# EAGLE schematic LEMSv2 (EAGLE 7.6.0)
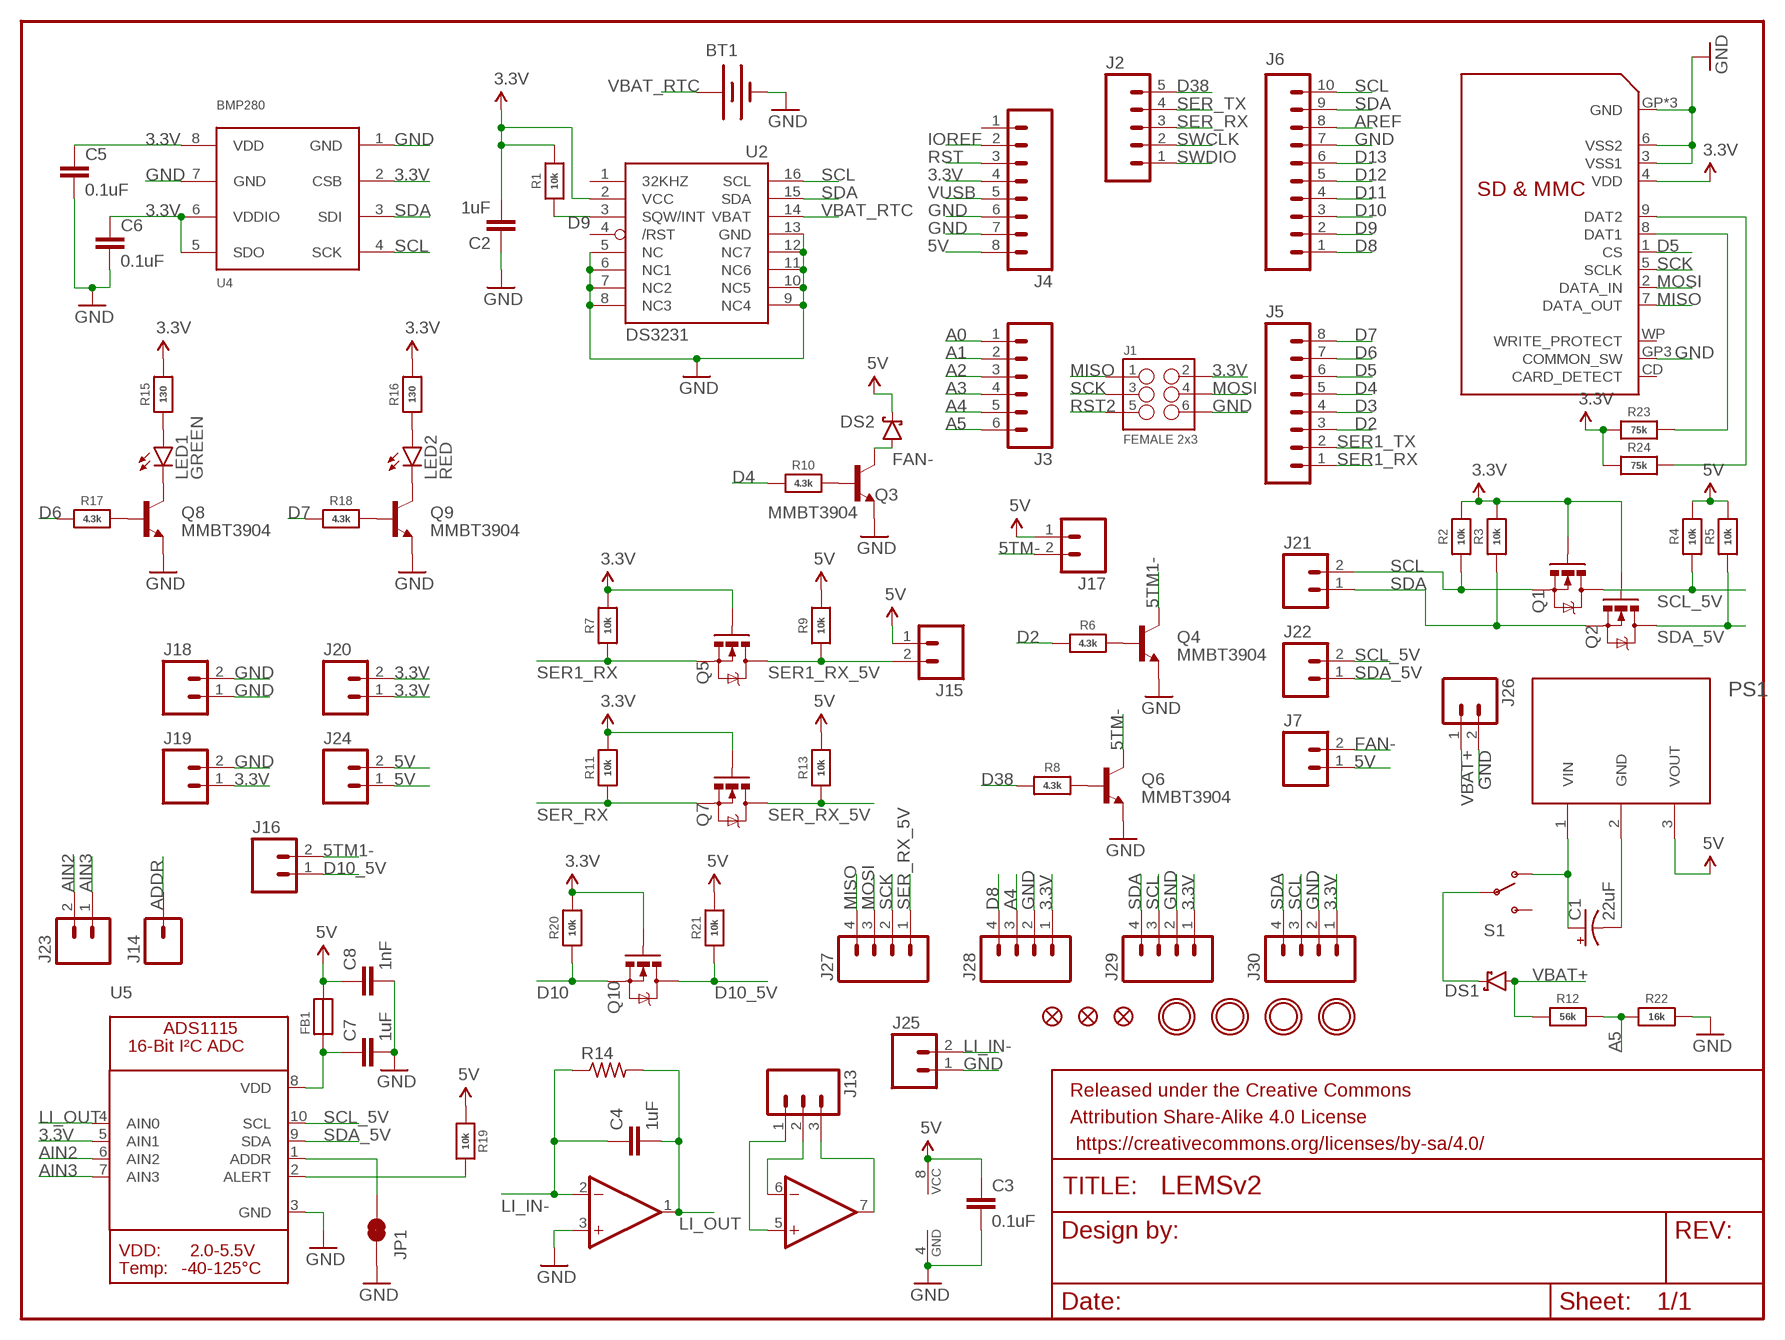
[diagram p0: schematic, sheet 1]

## Parts
BT1  BATTERY12MM  [BATTCON_12MM]
C1  22uF  CAP_POLPTH2  [CPOL-RADIAL-10UF-25V]
C2  1uF  CAP  [_0805]
C3  0.1uF  CAP  [_0805]
C4  1uF  CAP  [_0805]
C5  0.1uF  CAP  [_0805]
C6  0.1uF  CAP  [_0805]
C7  1uF  CAP  [_0805]
C8  1nF  CAP  [_0805]
DS1  DIODE_SCHOTTKY  [DO-214AC]
DS2  DIODE_SCHOTTKY  [DO-214AC]
FB1  FERRITE  [_0805]
FID1  FIDUCIAL""  [FIDUCIAL_1MM]
FID2  FIDUCIAL""  [FIDUCIAL_1MM]
FID3  FIDUCIAL""  [FIDUCIAL_1MM]
FRAME1  FRAME-LETTERNO_PACKAGE  [DUMMY]
J1  FEMALE 2x3  M03X2FEMALE  [2X3]
J2  M05PTH  [1X05]
J3  M06SILK_FEMALE_PTH  [1X06]
J4  M08  [1X08_ROUND]
J5  M08  [1X08_ROUND]
J6  M10SILK_FEMALE_PTH  [1X10]
J7  M023.5MM  [SCREWTERMINAL-3.5MM-2]
J13  M03PTH  [1X03]
J14  M01PTH  [1X01]
J15  M023.5MM  [SCREWTERMINAL-3.5MM-2]
J16  M023.5MM  [SCREWTERMINAL-3.5MM-2]
J17  M023.5MM  [SCREWTERMINAL-3.5MM-2]
J18  M023.5MM  [SCREWTERMINAL-3.5MM-2]
J19  M023.5MM  [SCREWTERMINAL-3.5MM-2]
J20  M023.5MM  [SCREWTERMINAL-3.5MM-2]
J21  M023.5MM  [SCREWTERMINAL-3.5MM-2]
J22  M023.5MM  [SCREWTERMINAL-3.5MM-2]
J23  M023.5MM  [SCREWTERMINAL-3.5MM-2]
J24  M023.5MM  [SCREWTERMINAL-3.5MM-2]
J25  M023.5MM  [SCREWTERMINAL-3.5MM-2]
J26  M023.5MM  [SCREWTERMINAL-3.5MM-2]
J27  M04SCREW  [SCREWTERMINAL-3.5MM-4]
J28  M04SCREW  [SCREWTERMINAL-3.5MM-4]
J29  M04SCREW  [SCREWTERMINAL-3.5MM-4]
J30  M04SCREW  [SCREWTERMINAL-3.5MM-4]
JP1  JUMPER-PAD-2-NC_BY_TRACE  [PAD-JUMPER-2-NC_BY_TRACE_YES_SILK]
LED1  GREEN  LED_GREEN  [LED-0603]
LED2  RED  LED_RED  [LED-0603]
PS1  TSR_1-2450  [TSR_1-2450]
Q1  200mA/50V  MOSFET-NCHANNELBSS138  [SOT23-3]
Q2  200mA/50V  MOSFET-NCHANNELBSS138  [SOT23-3]
Q3  MMBT3904  [SOT23-3]
Q4  MMBT3904  [SOT23-3]
Q5  200mA/50V  MOSFET-NCHANNELBSS138  [SOT23-3]
Q6  MMBT3904  [SOT23-3]
Q7  200mA/50V  MOSFET-NCHANNELBSS138  [SOT23-3]
Q8  MMBT3904  [SOT23-3]
Q9  MMBT3904  [SOT23-3]
Q10  200mA/50V  MOSFET-NCHANNELBSS138  [SOT23-3]
R1  10k  RESISTOR_0805  [_0805]
R2  10k  RESISTOR_0805  [_0805]
R3  10k  RESISTOR_0805  [_0805]
R4  10k  RESISTOR_0805  [_0805]
R5  10k  RESISTOR_0805  [_0805]
R6  4.3k  RESISTOR_0805  [_0805]
R7  10k  RESISTOR_0805  [_0805]
R8  4.3k  RESISTOR_0805  [_0805]
R9  10k  RESISTOR_0805  [_0805]
R10  4.3k  RESISTOR_0805  [_0805]
R11  10k  RESISTOR_0805  [_0805]
R12  56k  RESISTOR_0805  [_0805]
R13  10k  RESISTOR_0805  [_0805]
R14  R-US_FLIPFLOP  [0805-THM]
R15  130  RESISTOR_0805  [_0805]
R16  130  RESISTOR_0805  [_0805]
R17  4.3k  RESISTOR_0805  [_0805]
R18  4.3k  RESISTOR_0805  [_0805]
R19  10k  RESISTOR_0805  [_0805]
R20  10k  RESISTOR_0805  [_0805]
R21  10k  RESISTOR_0805  [_0805]
R22  16k  RESISTOR_0805  [_0805]
R23  75k  RESISTOR_0805  [_0805]
R24  75k  RESISTOR_0805  [_0805]
S1  SWITCH-SPDTPTH  [SWITCH-SPDT]
U1  SDMMC06132  [06132]
U2  DS3231/SO  [SO16W]
U3  TLV2372  [SOIC8]
U4  BMP280  [BMP280]
U5  ADC_ADS1115  [MSOP10]
U$1  MOUNTINGHOLE2.5  [MOUNTINGHOLE_2.5_PLATED]
U$2  MOUNTINGHOLE2.5  [MOUNTINGHOLE_2.5_PLATED]
U$3  MOUNTINGHOLE2.5  [MOUNTINGHOLE_2.5_PLATED]
U$4  MOUNTINGHOLE2.5  [MOUNTINGHOLE_2.5_PLATED]

## Nets
3.3V: C2.2 C5.1 C6.1 J1.2 J4.4 J19.1 J20.1 J20.2 J28.1 J29.1 J30.1 Q1.1(G) Q2.1(G) Q5.1(G) Q7.1(G) Q10.1(G) R1.2 R2.2 R3.2 R7.2 R11.2 R15.2 R16.2 R20.2 R23.1 R24.1 U1.4(VDD) U2.2(VCC) U4.2(CSB) U4.5(SDO) U4.6(VDDIO) U4.8(VDD) U5.5(AIN1)
5TM1-: J16.2 Q4.3(C)
5TM-: J17.2 Q6.3(C)
5V: C3.1 C8.1 DS2.C FB1.2 J4.8 J7.1 J15.1 J17.1 J24.1 J24.2 PS1.3(VOUT) R4.2 R5.2 R9.2 R13.2 R19.1 R21.2 U3.8(TLV2372-PWRN:VCC)
A0: J3.1
A1: J3.2
A2: J3.3
A3: J3.4
A4: J3.5 J28.3
A5: J3.6 R12.2 R22.1
ADDR: J14.1 JP1.1 U5.1(ADDR)
AIN2: J23.2 U5.6(AIN2)
AIN3: J23.1 U5.7(AIN3)
ALERT: R19.2 U5.2(ALERT)
AREF: J6.8
D2: J5.3 R6.1
D3: J5.4
D4: J5.5 R10.1
D5: J5.6 U1.1(CS)
D6: J5.7 R17.1
D7: J5.8 R18.1
D8: J6.1 J28.4
D9: J6.2 R1.1 U2.3(SQW/INT)
D10: J6.3 Q10.2(S) R20.1
D10_5V: J16.1 Q10.3(D) R21.1
D11: J6.4
D12: J6.5
D13: J6.6
D38: J2.5 R8.1
FAN-: DS2.A J7.2 Q3.3(C)
GND: BT1.GND(-) C1.2(-) C2.1 C3.2 C5.2 C6.2 C7.2 C8.2 J1.6 J4.6 J4.7 J6.7 J18.1 J18.2 J19.2 J25.1 J26.2 J28.2 J29.2 J30.2 JP1.2 PS1.2(GND) Q3.2(E) Q4.2(E) Q6.2(E) Q8.2(E) Q9.2(E) R22.2 U1.3(VSS1) U1.6(VSS2) U1.GP2(GND) U1.GP3(COMMON_SW) U1.GP4(GND) U1.GP(GND) U2.5(NC) U2.6(NC1) U2.7(NC2) U2.8(NC3) U2.9(NC4) U2.10(NC5) U2.11(NC6) U2.12(NC7) U2.13(GND) U3.3(TLV2372-1:+IN) U3.4(TLV2372-PWRN:GND) U4.1(GND) U4.7(GND) U5.3(GND)
IOREF: J4.2
LI_IN-: C4.1 J25.2 R14.1 U3.2(TLV2372-1:-IN)
LI_OUT: C4.2 R14.2 U3.1(TLV2372-1:OUT) U5.4(AIN0)
MISO: J1.1 J27.4 U1.7(DATA_OUT)
MOSI: J1.4 J27.3 U1.2(DATA_IN)
N$1: C1.1(+) PS1.1(VIN) S1.1(O)
N$2: J13.2 U3.6(TLV2372-2:-IN)
N$3: J13.1 U3.5(TLV2372-2:+IN)
N$4: J13.3 U3.7(TLV2372-2:OUT)
N$5: Q8.1(B) R17.2
N$6: Q9.1(B) R18.2
N$7: LED1.C Q8.3(C)
N$8: LED2.C Q9.3(C)
N$9: LED1.A R15.1
N$10: LED2.A R16.1
N$11: Q4.1(B) R6.2
N$12: Q6.1(B) R8.2
N$13: DS1.C S1.2(P)
N$14: C7.1 FB1.1 U5.8(VDD)
N$15: Q3.1(B) R10.2
N$17: R23.2 U1.8(DAT1)
N$18: R24.2 U1.9(DAT2)
RST: J4.3
RST2: J1.5
SCK: J1.3 J27.2 U1.5(SCLK)
SCL: J6.10 J21.2 J29.3 J30.3 Q1.2(S) R2.1 U2.16(SCL) U4.4(SCK)
SCL_5V: J22.2 Q1.3(D) R4.1 U5.10(SCL)
SDA: J6.9 J21.1 J29.4 J30.4 Q2.2(S) R3.1 U2.15(SDA) U4.3(SDI)
SDA_5V: J22.1 Q2.3(D) R5.1 U5.9(SDA)
SER1_RX: J5.1 Q5.2(S) R7.1
SER1_RX_5V: J15.2 Q5.3(D) R9.1
SER1_TX: J5.2
SER_RX: J2.3 Q7.2(S) R11.1
SER_RX_5V: J27.1 Q7.3(D) R13.1
SER_TX: J2.4
SWCLK: J2.2
SWDIO: J2.1
VBAT+: DS1.A J26.1 R12.1
VBAT_RTC: BT1.PWR@1(+) U2.14(VBAT)
VUSB: J4.5
Unconnected: J4.1 S1.3(S) U1.CD(CARD_DETECT) U1.WP(WRITE_PROTECT) U2.1(32KHZ) U2.4(/RST)

## Library data of the parts
BT1 = LEMSv2:BATTERY: Battery Holders Various common sizes : AA, AAA, 18650 (PRT-12895), 20mm coin cell and 12mm coin cell. 20MM_4LEGS, BATT-10373; PROD_ID: BATT-08044
C1 = LEMSv2:CAP_POL: Capacitor Polarized These are standard SMD and PTH capacitors. Normally 10uF, 47uF, and 100uF in electrolytic and tantalum varieties. Always verify the external diameter of the through hole cap, it varies with capacity, voltage, and manufacturer. The EIA devices should be standard.
C2-C8 = LEMSv2:CAP: Capacitor Standard 0603 ceramic capacitor, and 0.1" leaded capacitor.
DS1 DS2 = LEMSv2:DIODE_SCHOTTKY
FB1 = LEMSv2:FERRITE: 0805 Ferrite Bead
FID1-FID3 = LEMSv2:FIDUCIAL: Fiducial Alignment Points Various fiducial points for machine vision alignment.; BOM: EXCLUDE
FRAME1 = SparkFun-Aesthetics:FRAME-LETTER: Schematic Frame Standard 8.5x11 US Letter frame; DESIGNER: Nobody; VERSION: v01
J1 = LEMSv2:M03X2: 2x3 .1" header. Shrouded, with keying- CONN-10681 SMT- CONN-11415 Pogo pins- HW-11044; PROD_ID: CONN-11566
J2 = SparkFun-Connectors:M05: Header 5 Standard 5-pin 0.1" header. Use with straight break away headers (SKU : PRT-00116), right angle break away headers (PRT-00553), swiss pins (PRT-00743), machine pins (PRT-00117), and female headers (PRT-00115). Molex polarized connector foot print use with SKU : PRT-08230 with associated crimp pins and housings.
J3 = LEMSv2:M06: Header 6 Standard 6-pin 0.1" header. Use with straight break away headers (SKU : PRT-00116), right angle break away headers (PRT-00553), swiss pins (PRT-00743), machine pins (PRT-00117), and female headers (PRT-00115). Molex polarized connector foot print use with SKU : PRT-08094 with associated crimp pins and housings. NOTES ON THE VARIANTS LOCK and LOCK_LONGPADS... This footprint was designed to help hold the alignment of a through-hole component (i.e. 6-pin header) while soldering it into place. You may notice that each hole has been shifted either up or down by 0.005 of an inch from it's more standard position (which is a perfectly straight line). This slight alteration caused the pins (the squares in the middle) to touch the edges of the holes. Because they are alternating, it causes a "brace" to hold the component in place. 0.005 has proven to be the perfect amount of "off-center" position when using our standard breakaway headers. Although looks a little odd when you look at the bare footprint, once you have a header in there, the alteration is very hard to notice. Also,if you push a header all the way into place, it is covered up entirely on the bottom side. This idea of altering the position of holes to aid alignment will be further integrated into the Sparkfun Library for other footprints. It can help hold any component with 3 or more connection pins.; PROD_ID: CONN-08437
J4 J5 = LEMSv2:M08: Header 8 Standard 8-pin 0.1" header. Use with straight break away headers (SKU : PRT-00116), right angle break away headers (PRT-00553), swiss pins (PRT-00743), machine pins (PRT-00117), and female headers (PRT-00115).; PROD_ID: CONN-08437
J6 = LEMSv2:M10: Header 10 Standard 10-pin 0.1" header. Use with straight break away headers (SKU : PRT-00116), right angle break away headers (PRT-00553), swiss pins (PRT-00743), machine pins (PRT-00117), and female headers (PRT-00115).; PROD_ID: CONN-11563
J7 J15-J26 = LEMSv2:M02: Standard 2-pin 0.1" header. Use with - straight break away headers ( PRT-00116) - right angle break away headers (PRT-00553) - swiss pins (PRT-00743) - machine pins (PRT-00117) - female headers (PRT-00115) Molex polarized connector foot print use with: PRT-08233 with associated crimp pins and housings. 2.54_SCREWTERM for use with PRT-10571. 3.5mm Screw Terminal footprints for PRT-08084 5mm Screw Terminal footprints for use with PRT-08432; PROD_ID: CONN-08399
J13 = LEMSv2:M03: Header 3 Standard 3-pin 0.1" header. Use with straight break away headers (SKU : PRT-00116), right angle break away headers (PRT-00553), swiss pins (PRT-00743), machine pins (PRT-00117), and female headers (PRT-00115). Molex polarized connector foot print use with SKU : PRT-08232 with associated crimp pins and housings.
J14 = SparkFun-Connectors:M01: Header 1 Standard 1-pin 0.1" header. Use with straight break away headers (SKU : PRT-00116), right angle break away headers (PRT-00553), swiss pins (PRT-00743), machine pins (PRT-00117), and female headers (PRT-00115). SMTSO-256-ET is a "flush mount" nut for a 4-40 screw. The older package used to be too tight, and did not allow it to sit properly thru the drill hit. The latest (0.165DIA) fits nice and snug.
J27-J30 = LEMSv2:M04: Header 4 Standard 4-pin 0.1" header. Use with straight break away headers (SKU : PRT-00116), right angle break away headers (PRT-00553), swiss pins (PRT-00743), machine pins (PRT-00117), and female headers (PRT-00115). Molex polarized connector foot print use with SKU : PRT-08231 with associated crimp pins and housings. 1MM SMD Version SKU: PRT-10208; PROD_ID: Combine 2x8399
JP1 = SparkFun-Passives:JUMPER-PAD-2-NC_BY_TRACE
LED1 = LEMSv2:LED_GREEN: Green 0603 LED - Lite-On LTST-C190GKT - https://octopart.com/ltst-c190gkt-lite-on-549821
LED2 = LEMSv2:LED_RED: Green 0603 LED - Lite-On LTST-C190KRKT - https://octopart.com/ltst-c190krkt-lite-on-549893
PS1 = LEMSv2:TSR_1-2450: Traco TSR 1-2450 - DC/DC Step-Down Converter 6.5 - 36VDC input with input capacitor 6.5 - 32VDC input w/out input capacitor 5VDC output
Q1 Q2 = SparkFun-DiscreteSemi:MOSFET-NCHANNEL: Common NMOSFET Parts MFG P/N Store ID Prod ID FDD8780 TRANS-09984 SI7820DN TRANS-11055 FDS6630A IC-08089 2N7002PW TRANS-11151 FQP30N06L COM-10213 TRANS-10060 BSS123LT1G TRANS-08345 BSS138 TRANS-00830 BS170 2N7000; PROD_ID: TRANS-00830
Q3 Q4 Q6 Q8 Q9 = LEMSv2:MMBT3904
Q5 Q7 Q10 = LEMSv2:MOSFET-NCHANNEL: Common NMOSFET Parts MFG P/N Store ID Prod ID FDD8780 TRANS-09984 SI7820DN TRANS-11055 FDS6630A IC-08089 2N7002PW TRANS-11151 FQP30N06L COM-10213 TRANS-10060 BSS123LT1G TRANS-08345 BSS138 TRANS-00830 BS170 2N7000; PROD_ID: TRANS-00830
R1-R13 R15-R24 = LEMSv2:RESISTOR: Resistors For new designs, use the packages preceded by an '_' character since they are more reliable: The following footprints should be used on most boards: _0402 - Standard footprint for regular board layouts _0603 - Standard footprint for regular board layouts _0805 - Standard footprint for regular board layouts _1206 - Standard footprint for regular board layouts For extremely tight-pitch boards where space is at a premium, the following 'micro-pitch' footprints can be used (smaller pads, no silkscreen outline, etc.): _0402MP - Micro-pitch footprint for very dense/compact boards _0603MP - Micro-pitch footprint for very dense/compact boards _0805MP - Micro-pitch footprint for very dense/compact boards _1206MP - Micro-pitch footprint for very dense/compact boards
R14 = adafruit:R-US_: RESISTOR, American symbol
S1 = SparkFun-Electromechanical:SWITCH-SPDT: SPDT Switch Simple slide switch, Spark Fun Electronics SKU : COM-00102 DPDT SMT slide switch, AYZ0202, SWCH-08179; PROD_ID: SWCH-08261
U1 = LEMSv2:SDMMC: SD MMC Card holder 4UCON part #06132 - easy to solder
U2 = LEMSv2:DS3231
U3 = LEMSv2:TLV2372: 2-Channel Single-Supply Rail-to-Rail Op-Amp by TI
U4 = LEMSv2:BMP280: BMP280 - Digital Pressure Sensor Technical Specifications: VCC: 1.2-3.6V Operating Temperature: -40°C to 85°C Full Range: 300-11100 hPa
U5 = LEMSv2:ADC_ADS1115: ADS1115 - 16-bit 4-Channel I2C ADC with Internal PGA VDD: 2.0-5.5V Sampling Rate: 8-860ksps Gain Settings: 2/3, 1, 2, 4, 8, 16
U$1-U$4 = LEMSv2:MOUNTINGHOLE: Mounting Hole For #2 screws (0.086"/2.18mm width, 0.094"/2.4mm hole) use 2.5mm; BOM: EXCLUDE